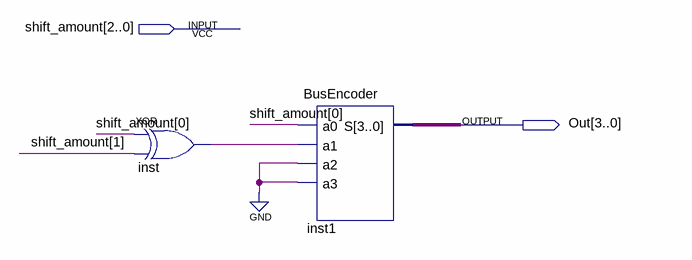
[diagram p0: schematic sheet]
// Quartus schematic ShiftAmountToExp.bdf as structural Verilog: 2 symbols, 2 pins
module ShiftAmountToExp (
  input  [2:0] shift_amount,
  output [3:0] Out
);

  wire inst_out;

  xor inst (inst_out, shift_amount[0], shift_amount[1]);
  BusEncoder inst1 (.a0(shift_amount[0]), .a1(inst_out), .a2(1'b0), .a3(1'b0), .S(Out));
endmodule
